# EAGLE design MPL3115A2_v0.2 (EAGLE 6.4)
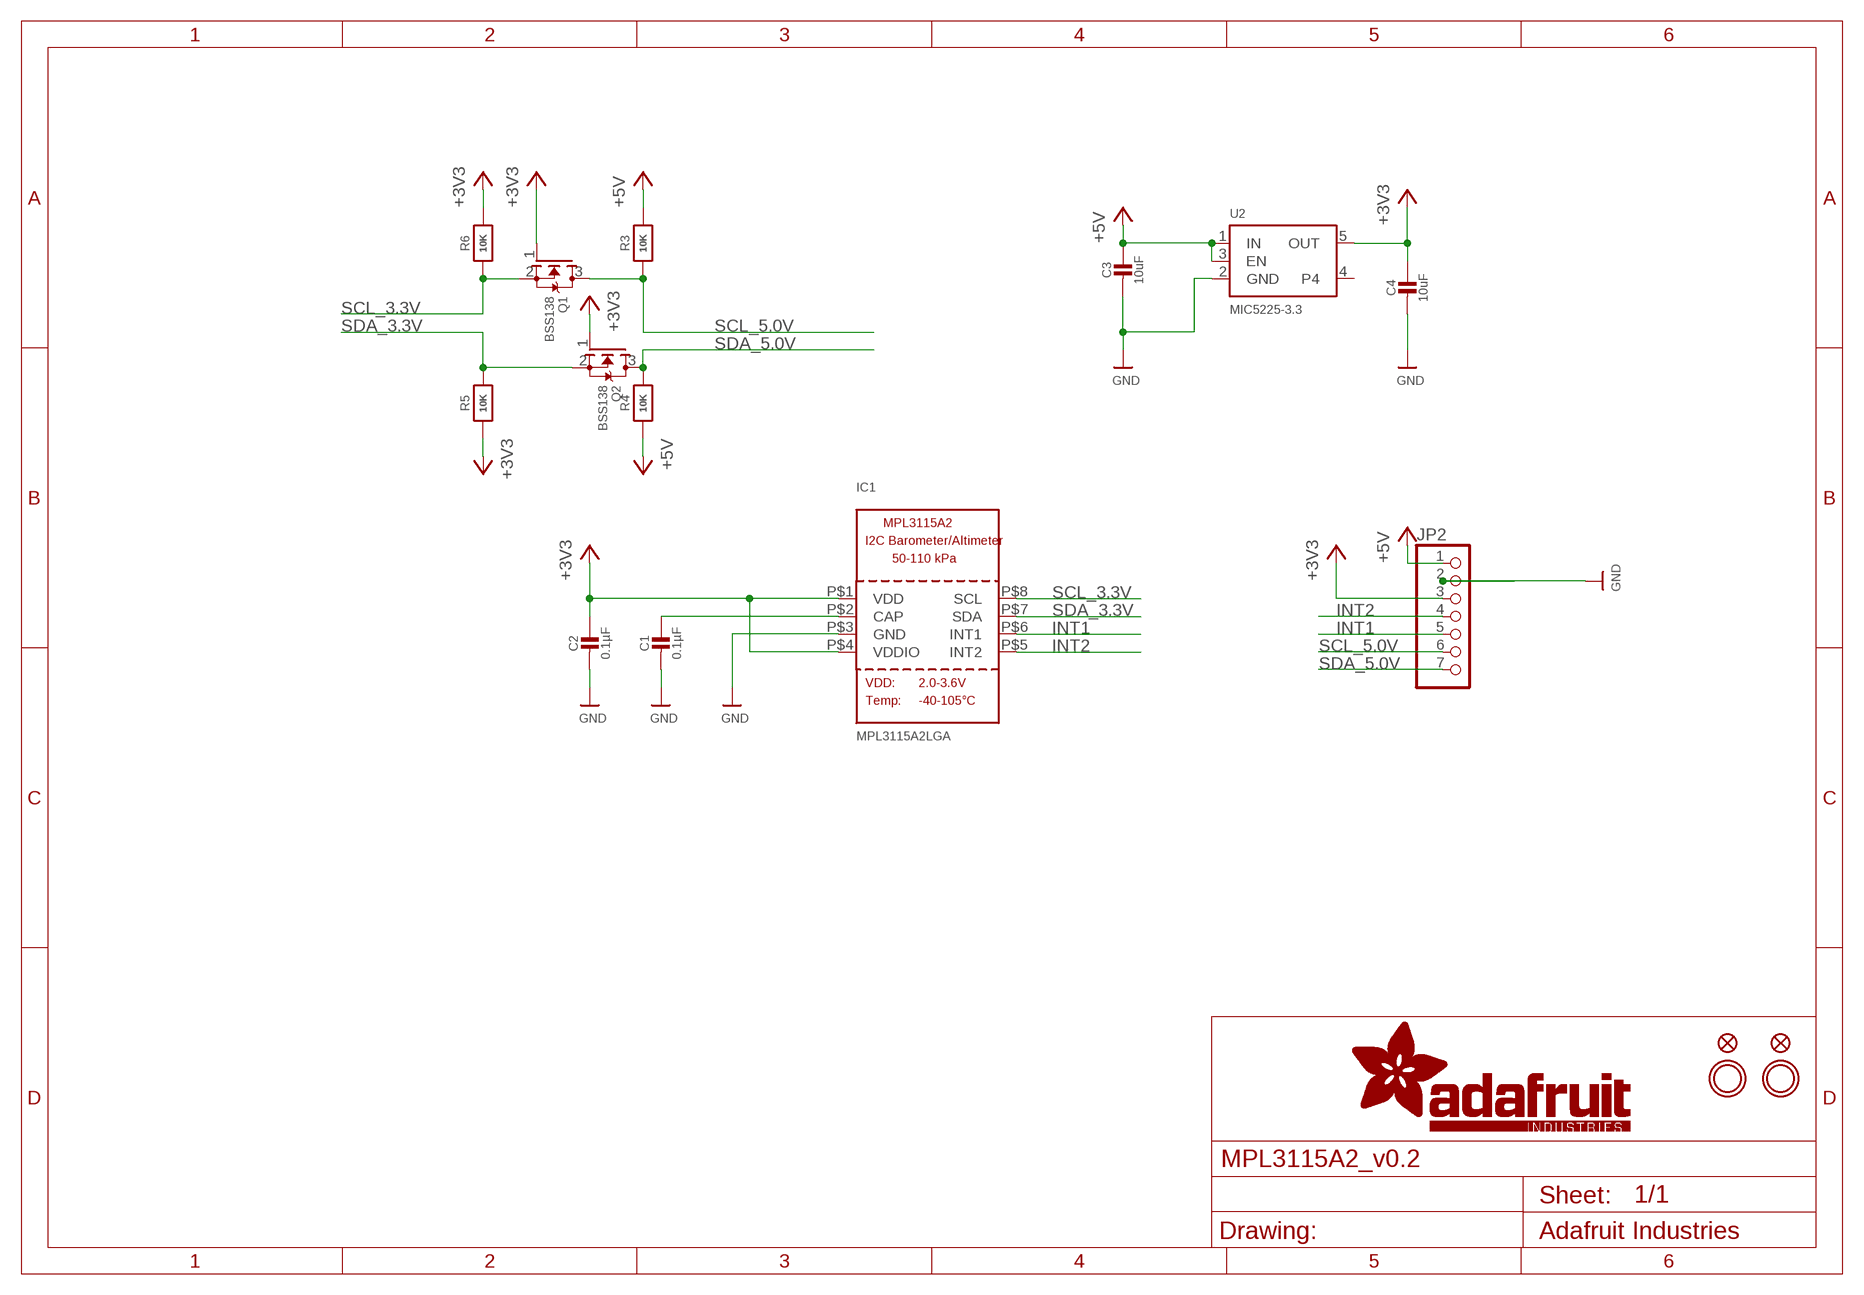
[diagram p0: schematic, sheet 1]

## Parts
C1  0.1µF  CAP_CERAMIC0805-NOOUTLINE  [0805-NO]
C2  0.1µF  CAP_CERAMIC0805-NOOUTLINE  [0805-NO]
C3  10uF  CAP_CERAMIC0805-NOOUTLINE  [0805-NO]
C4  10uF  CAP_CERAMIC0805-NOOUTLINE  [0805-NO]
FID1  FIDUCIAL""  [FIDUCIAL_1MM]
FID2  FIDUCIAL""  [FIDUCIAL_1MM]
IC1  MPL3115A2LGA  [LGA8]
JP2  HEADER-1X770MIL  [1X07_ROUND_70]
Q1  BSS138  MOSFET-NWIDE  [SOT23-WIDE]
Q2  BSS138  MOSFET-NWIDE  [SOT23-WIDE]
R3  10K  RESISTOR0805_NOOUTLINE  [0805-NO]
R4  10K  RESISTOR0805_NOOUTLINE  [0805-NO]
R5  10K  RESISTOR0805_NOOUTLINE  [0805-NO]
R6  10K  RESISTOR0805_NOOUTLINE  [0805-NO]
U2  MIC5225-3.3  VREG_SOT23-5  [SOT23-5]
U$8  MOUNTINGHOLE2.5  [MOUNTINGHOLE_2.5_PLATED]
U$9  MOUNTINGHOLE2.5  [MOUNTINGHOLE_2.5_PLATED]

## Nets
+3V3: C2.1 C4.1 IC1.P$1(VDD) IC1.P$4(VDDIO) JP2.3 Q1.1(G) Q2.1(G) R5.1 R6.2 U2.5(OUT)
+5V: C3.1 JP2.1 R3.2 R4.1 U2.1(IN) U2.3(EN)
CAP: C1.1 IC1.P$2(CAP)
GND: C1.2 C2.2 C3.2 C4.2 IC1.P$3(GND) JP2.2 U2.2(GND)
INT1: IC1.P$6(INT1) JP2.5
INT2: IC1.P$5(INT2) JP2.4
SCL_3.3V: IC1.P$8(SCL) Q1.2(S) R6.1
SCL_5.0V: JP2.6 Q1.3(D) R3.1
SDA_3.3V: IC1.P$7(SDA) Q2.2(S) R5.2
SDA_5.0V: JP2.7 Q2.3(D) R4.2
Unconnected: U2.4

## Library data of the parts
C1-C4 = microbuilder:CAP_CERAMIC: Ceramic Capacitors For new designs, use the packages preceded by an '_' character since they are more reliable: The following footprints should be used on most boards: _0402 - Standard footprint for regular board layouts _0603 - Standard footprint for regular board layouts _0805 - Standard footprint for regular board layouts _1206 - Standard footprint for regular board layouts For extremely tight-pitch boards where space is at a premium, the following 'micro-pitch' footprints can be used (smaller pads, no silkscreen outline, etc.): _0402MP - Micro-pitch footprint for very dense/compact boards _0603MP - Micro-pitch footprint for very dense/compact boards _0805MP - Micro-pitch footprint for very dense/compact boards _1206MP - Micro-pitch footprint for very dense/compact boards
FID1 FID2 = microbuilder:FIDUCIAL: Fiducial Alignment Points Various fiducial points for machine vision alignment.; BOM: EXCLUDE
IC1 = microbuilder:MPL3115A2
JP2 = microbuilder:HEADER-1X7: PIN HEADER
Q1 Q2 = microbuilder:MOSFET-N: N-Channel Mosfet LEGEND VDS: Voltage Drain-Source ID: Drain Current RDS(ON): Drain-Source On-State Resistance VGS(TH): Gate-Source Threshold Voltage CISS: Drain-Source Input Capacitance SOT-23 Name VDS ID RDS(ON) VGS(TH) CISS Order Number 2N7002E 60V 260mA 2.5 Ohm 2.5V @ 250uA 26.7pF @ 25V 2N7002ET1GOSTR-ND BSH103 30V 850mA 400 mOhm 400mV @ 1mA 83pF @ 24V BSH103,235-ND BSS138 60V 320mA 1.6 Ohm 1.5V @ 250uA 50pF @ 10V Mouser: 771-BSS138PW115 DMN2075U-7 20V 4.2A 38 mOhm 1V @ 250 uA 594.3pF @ 10V DMN2075U-7DICT-ND * BSS138 good choice for I2C level-shifting POWERPAK 1212-8 Name VDS ID RDS(ON) VGS(TH) CISS Order Number Si7308DN 60V 6A 58 mOhm 3V @ 250uA 665pF @ 15V SI7308DN-T1-E3CT-ND
R3-R6 = microbuilder:RESISTOR: Resistors For new designs, use the packages preceded by an '_' character since they are more reliable: The following footprints should be used on most boards: _0402 - Standard footprint for regular board layouts _0603 - Standard footprint for regular board layouts _0805 - Standard footprint for regular board layouts _1206 - Standard footprint for regular board layouts For extremely tight-pitch boards where space is at a premium, the following 'micro-pitch' footprints can be used (smaller pads, no silkscreen outline, etc.): _0402MP - Micro-pitch footprint for very dense/compact boards _0603MP - Micro-pitch footprint for very dense/compact boards _0805MP - Micro-pitch footprint for very dense/compact boards _1206MP - Micro-pitch footprint for very dense/compact boards
U2 = microbuilder:VREG_SOT23-5: SOT23-5 Fixed Voltage Regulators Part Current Out V Out V In V Dropout θJA (°C/W) TJ (°C) Digikey Part No. ADP121 150mA 3.3V 3.4-5.5V 0.09V @ 150mA -- -- ADP121-AUJZ33R7CT-ND ADP121 150mA 3.0V 3.1-5.5V 0.09V @ 150mA -- -- ADP121-AUJZ30R7CT-ND ADP122 300mA 3.3V 3.4-5.5V 0.085V @ 300mA -- -- ADP122AUJZ-3.3-R7CT-ND ADP1712 300mA 3.3V 3.5-5.5V 0.17V @ 300mA -- -- ADP1712AUJZ-3.3-R7TR-ND AP7311 (Low Cost) 150mA 3.3V 3.5-6V 0.15V @ 150mA -- -- AP7311-33WG-7DICT-ND LD39015M18R 150mA 1.8V 1.9V-5.5V 0.08V @ 100mA -- -- 497-6977-1-ND LP2985A-33DBVR 150mA 3.3V 3.3-16V 0.28V @ 150mA 206 150 296-18479-1-ND MCP1824T-3302E/OT 300mA 3.3V 3.5V-6V 0.2V @ 300mA -- -- MCP1824T-3302E/OTCT-ND MIC5205-2.5YM5 TR 150mA 2.5V 2.7-16V 0.165V @ 150mA -- -- 576-1257-2-ND MIC5205-3.0YM5 TR 150mA 3.0V 3.2V-16V 0.165V @ 150mA -- -- 576-1258-2-ND MIC5205-3.3YM5 TR 150mA 3.3V 3.5V-16V 0.165V @ 150mA -- -- 576-1259-2-ND TPS780330220 150mA 3.3V+2.2V 3.6-5.5V 250mV Max -- -- 296-23332-1-ND TDA3663/N1,135 100mA 3.3V 3.5-45V 0.18V @ 50mA -- -- 568-5343-1-ND Max operating temp can be calculated using θJA, TJ (max junction temperature), and power in watts. Set the "Maximum Ambient Temperature" until it reaches TJ ("Max Junction Temperature"), which is the absolute limit for safe use of the regulator: Heat Sink Temperature Calculator <http://www.daycounter.com/Calculators/Heat-Sink-Temperature-Calculator.phtml> For example, With 12V source into a 3.3V LP2985 and a 30mA load, we are dissipating (12V-3.3V) * 0.03A = 0.261W. With a θJA of 206 °C/W, a TJ of 150°C, and 261mW we can safely use the chip without a heat sink up to 75°C (=147.1°C Junction Temperature).
U$8 U$9 = microbuilder:MOUNTINGHOLE: Mounting Hole For #2 screws (0.086"/2.18mm width, 0.094"/2.4mm hole) use 2.5mm; BOM: EXCLUDE

## Board
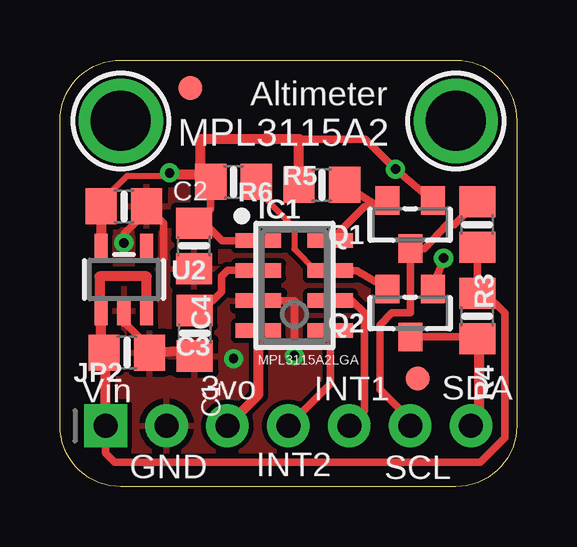
[diagram p1: board, top side]
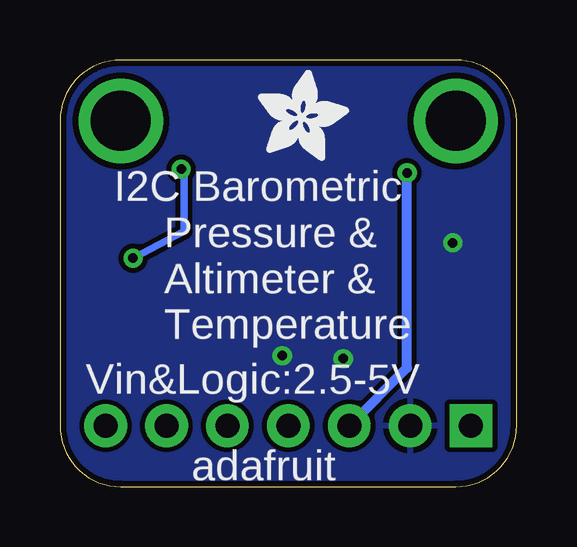
[diagram p2: board, bottom side, seen from below]

Size 19.05 x 17.78 mm. Coordinates in mm from the lower left corner, seen from the top.
Outline: 19.05,15.24 19.05,2.54 arc-90 16.51,0 2.54,0 arc-90 0,2.54 0,15.24 arc-90 2.54,17.78 16.51,17.78 arc-90 19.05,15.24
Copper layers (1*16): Top 0.035mm / dielectric 1.5mm / Bottom 0.035mm
Design rules "adafruit": minimum track width 8mil, minimum drill 15.5mil, track to track 8mil, track to pad 8mil, pad to pad 8mil, via to via 8mil, smd to smd 8mil, copper to edge 10mil, drill to drill 8mil, minimum pad ring 10mil, minimum via ring 8mil, stop-mask expansion 2mil, vias tented up to drill 20mil, thermal gap 10mil

### Footprints (pad centres in the part's own frame; a part is rotated, then mirrored left to right if it is on the bottom)
0805-NO = smd 1.3 x 1.5: 1 -0.95,0; 2 0.95,0
FIDUCIAL_1MM = smd 1 x 1: 1 0,0
LGA8 = smd 1.9 x 0.6: P$1 -1.5,1.875; P$2 -1.5,0.625; P$3 -1.5,-0.625; P$4 -1.5,-1.875; P$5 1.5,-1.875; P$6 1.5,-0.625; P$7 1.5,0.625; P$8 1.5,1.875
1X07_ROUND_70 = drill 1 pad 1.778 square: 1 -7.62,0 | drill 1 pad 1.778: 2 -5.08,0; 3 -2.54,0; 4 0,0; 5 2.54,0; 6 5.08,0; 7 7.62,0
SOT23-WIDE = smd 1 x 1.2: 1 -0.95,-1; 2 0.95,-1; 3 0,1
SOT23-5 = smd 0.55 x 1.2: 1 -0.95,-1.3; 2 0,-1.3; 3 0.95,-1.3; 4 0.95,1.3; 5 -0.95,1.3
MOUNTINGHOLE_2.5_PLATED = drill 2.5 pad 3.2: P$1 0,0

### Placement (x,y rotation side)
C1  5.62,6.4 270 top
C2  2.67,11.68 0 top
C3  2.79,5.59 0 top
C4  5.59,10.03 270 top
FID1  14.93,4.5 0 top
FID2  5.43,16.61 0 top
IC1  9.78,8.38 0 top
JP2  9.53,2.54 0 top
Q1  14.61,10.92 180 top
Q2  14.61,7.24 180 top
R3  17.4,10.92 270 top
R4  17.4,7.11 270 top
R5  7.24,12.7 0 top
R6  10.92,12.57 180 top
U2  2.67,8.64 0 top
U$8  2.54,15.24 0 top
U$9  16.51,15.24 0 top
U$14  [ADAFRUIT_3.5MM]  10.8,13.57 0 bottom

### Tracks (layer width: path | path; a pad name or v marks a point on that pad's centre or on a via)
+3V3  (via drill 0.39)
  Top 0.254: C2.1 1.72,11.88 2.79,12.95 4.95,12.95 5.78,13.02 6.35,13.08 R5.1
  Top 0.305: Q1.1 v13.99,13.23 12.74,14.48 9.97,14.48 | Q2.1 15.55,8.32 v16,9.53 | R5.1 6.29,11.56 C4.1 | IC1.P$1 6.75,10.26 6.16,10.86
  Top 0.406: C2.1 U2.5 | 6.16,10.86 C4.1 | R6.2 9.97,14.48 5.84,14.48 5.84,13.21 R5.1 | IC1.P$4 8.28,3.83 JP2.3 | v4.57,13.08 4.57,13.02 5.78,13.02
  Bottom 0.305: v16,9.53 13.87,10.65 13.87,13.36 v13.99,13.23
  Bottom 0.406: v4.57,13.08 4.57,4.95 JP2.3
+5V
  Top 0.305: R3.2 R4.1 17.78,8 18.54,7.24 18.54,2.03 17.53,1.02 2.29,1.02 1.91,1.4 1.91,3.05
  Top 0.406: JP2.1 1.91,3.05 1.91,5.91 C3.1 1.72,6.1 U2.1 1.65,7.72 1.65,8.76 3.62,8.76 U2.3
CAP
  Top 0.254: C1.1 5.82,7.35 | 7.49,9.02 IC1.P$2
  Top 0.305: 5.82,7.35 5.95,7.35 6.73,8.13 6.73,8.76 6.99,9.02 7.49,9.02
GND  (via drill 0.39)
  Top 0.254: 3.82,11.68 C2.2
  Top 0.305: 2.67,6.86 3.43,6.1 | IC1.P$3 9.78,7.76 v9.78,5.46 | v2.67,10.16 2.67,10.54 3.17,11.05 3.17,11.23 C2.2 4.32,10.97 4.32,9.53
  Top 0.406: U2.2 2.67,6.86 | 3.43,6.1 3.43,5.9 C3.2 5.48,5.71 C1.2
  Bottom 0.305: v9.78,5.46 9.78,5.21
  other vias: 7.24,5.33
  pour Bottom: -0.38,18.03 -0.38,-0.13 19.05,-0.13 19.05,18.03
  pour Top: -0.25,18.03 -0.25,-0.13 19.18,-0.13 19.18,18.03
INT1
  Top 0.305: IC1.P$6 12.18,7.76 12.7,7.24 12.7,3.17 JP2.5
INT2
  Top 0.305: IC1.P$5 11.28,4.29 JP2.4
SCL_3.3V
  Top 0.305: R6.1 13.29,11.67 Q1.2 12.69,11.67 IC1.P$8
SCL_5.0V
  Top 0.305: R3.1 16.45,10.92 16.13,10.92 15.2,9.92 Q1.3 14.61,7.24 13.84,7.24 13.34,6.73 13.34,4.06 14.73,2.67 JP2.6
SDA_3.3V
  Top 0.254: R5.2 8,12.57 9.78,10.79 9.78,9.91 10.68,9.01 IC1.P$7
  Top 0.305: IC1.P$7 12.38,9.01 Q2.2
SDA_5.0V
  Top 0.305: Q2.3 17.48,6.24 R4.2
  Top 0.406: 17.48,6.24 17.48,2.87 JP2.7

### Text on the board
tPlace: Altimeter | MPL3115A2 | Vin | 3vo | INT1 | SDA | GND | INT2 | SCL
bPlace: I2C Barometric | Pressure & / Altimeter & / Temperature | Vin&Logic:2.5-5V | adafruit